# Altium schematic sheet W5200_Evaluation_Notes.SchDoc
size B; Organization: ORGANIZATION; Address1: ADDRESS 1; Address2: ADDRESS 2; Address3: ADDRESS 3; Address4: ADDRESS 4; Revision: -; SheetNumber: 1; SheetTotal: 2; ENG_APP_DATE: --/--/--; DSN_APP_DATE: --/--/--; CHK_APP_DATE: --/--/--
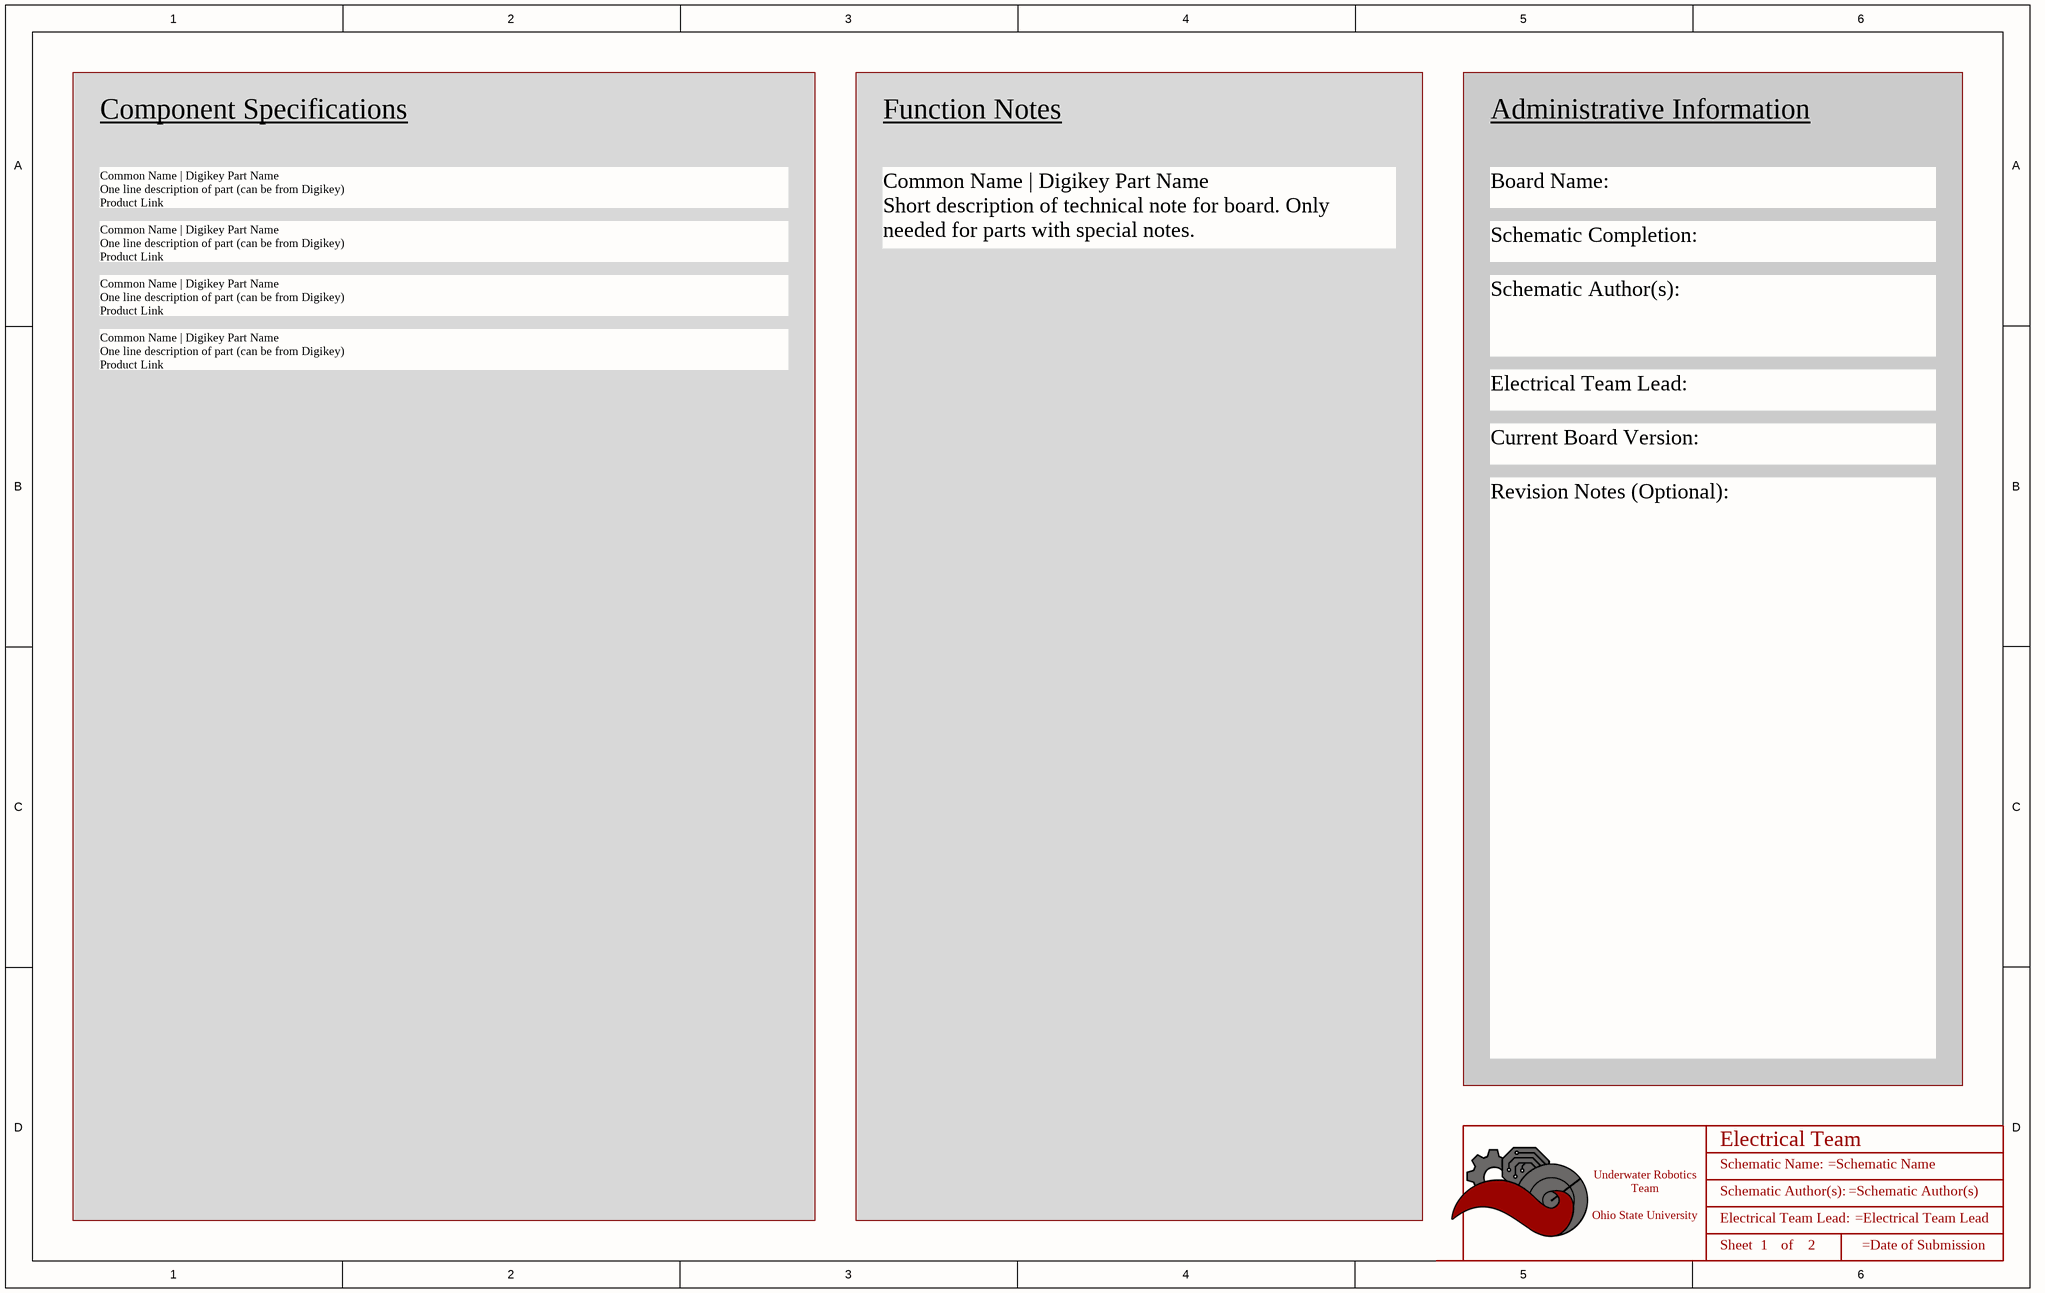
[diagram p0: W5200_Evaluation_Notes.SchDoc]

## Parts
*  Title_Block  (value not drawn)  (graphical)

## Notes on the sheet
- Component Specifications
- Function Notes
- Administrative Information
- Common Name | Digikey Part Name
  One line description of part (can be from Digikey)
  Product Link
- Board Name:
- Common Name | Digikey Part Name
  Short description of technical note for board. Only needed for parts with special notes.
- Schematic Completion:
- Schematic Author(s):
- Electrical Team Lead:
- Current Board Version:
- Revision Notes (Optional):
- DWG. NO.
- REV.
- SHT.
- THIS DOCUMENT AND THE DATA DISCLOSED HEREIN OR HEREWITH IS THE PROPERTY OF ALTIUM LIMITED AND MAY BE FREELY DISTRIBUTED IN WHOLE. NO RIGHTS ARE RESERVED OR EXPRESS OR IMPLIED WARANTEE GIVEN.
- REVISION
- DESCRIPTION
- DATE
- APPROVED
- ENG:
- APPROVALS
- PROJECT
- DSN:
- CHK:
- REFERENCE DOCUMENTS
- PROJECT REVISION:
- TITLE
- DOCUMENT REVISION:
- DESIGN ITEM:
- BOM:
- FAB DWG:
- PCB DWG:
- ASSY DWG:
- SCALE:
- SIZE
- B
- CAGE CODE
- FILE NAME
- DWG NO.
- SHEET
- OF
- REV
- (in symbol Title_Block) Electrical Team; Schematic Name:; Schematic Author(s):; Underwater Robotics Team / Ohio State University; Electrical Team Lead:; Sheet; of

## Library data of the parts
* = Title_Block: UWRT Schematic Title Block Template / Created June 2021, Dylan Trainor